# Altium project ROS-Robot-Controller.PrjPcb
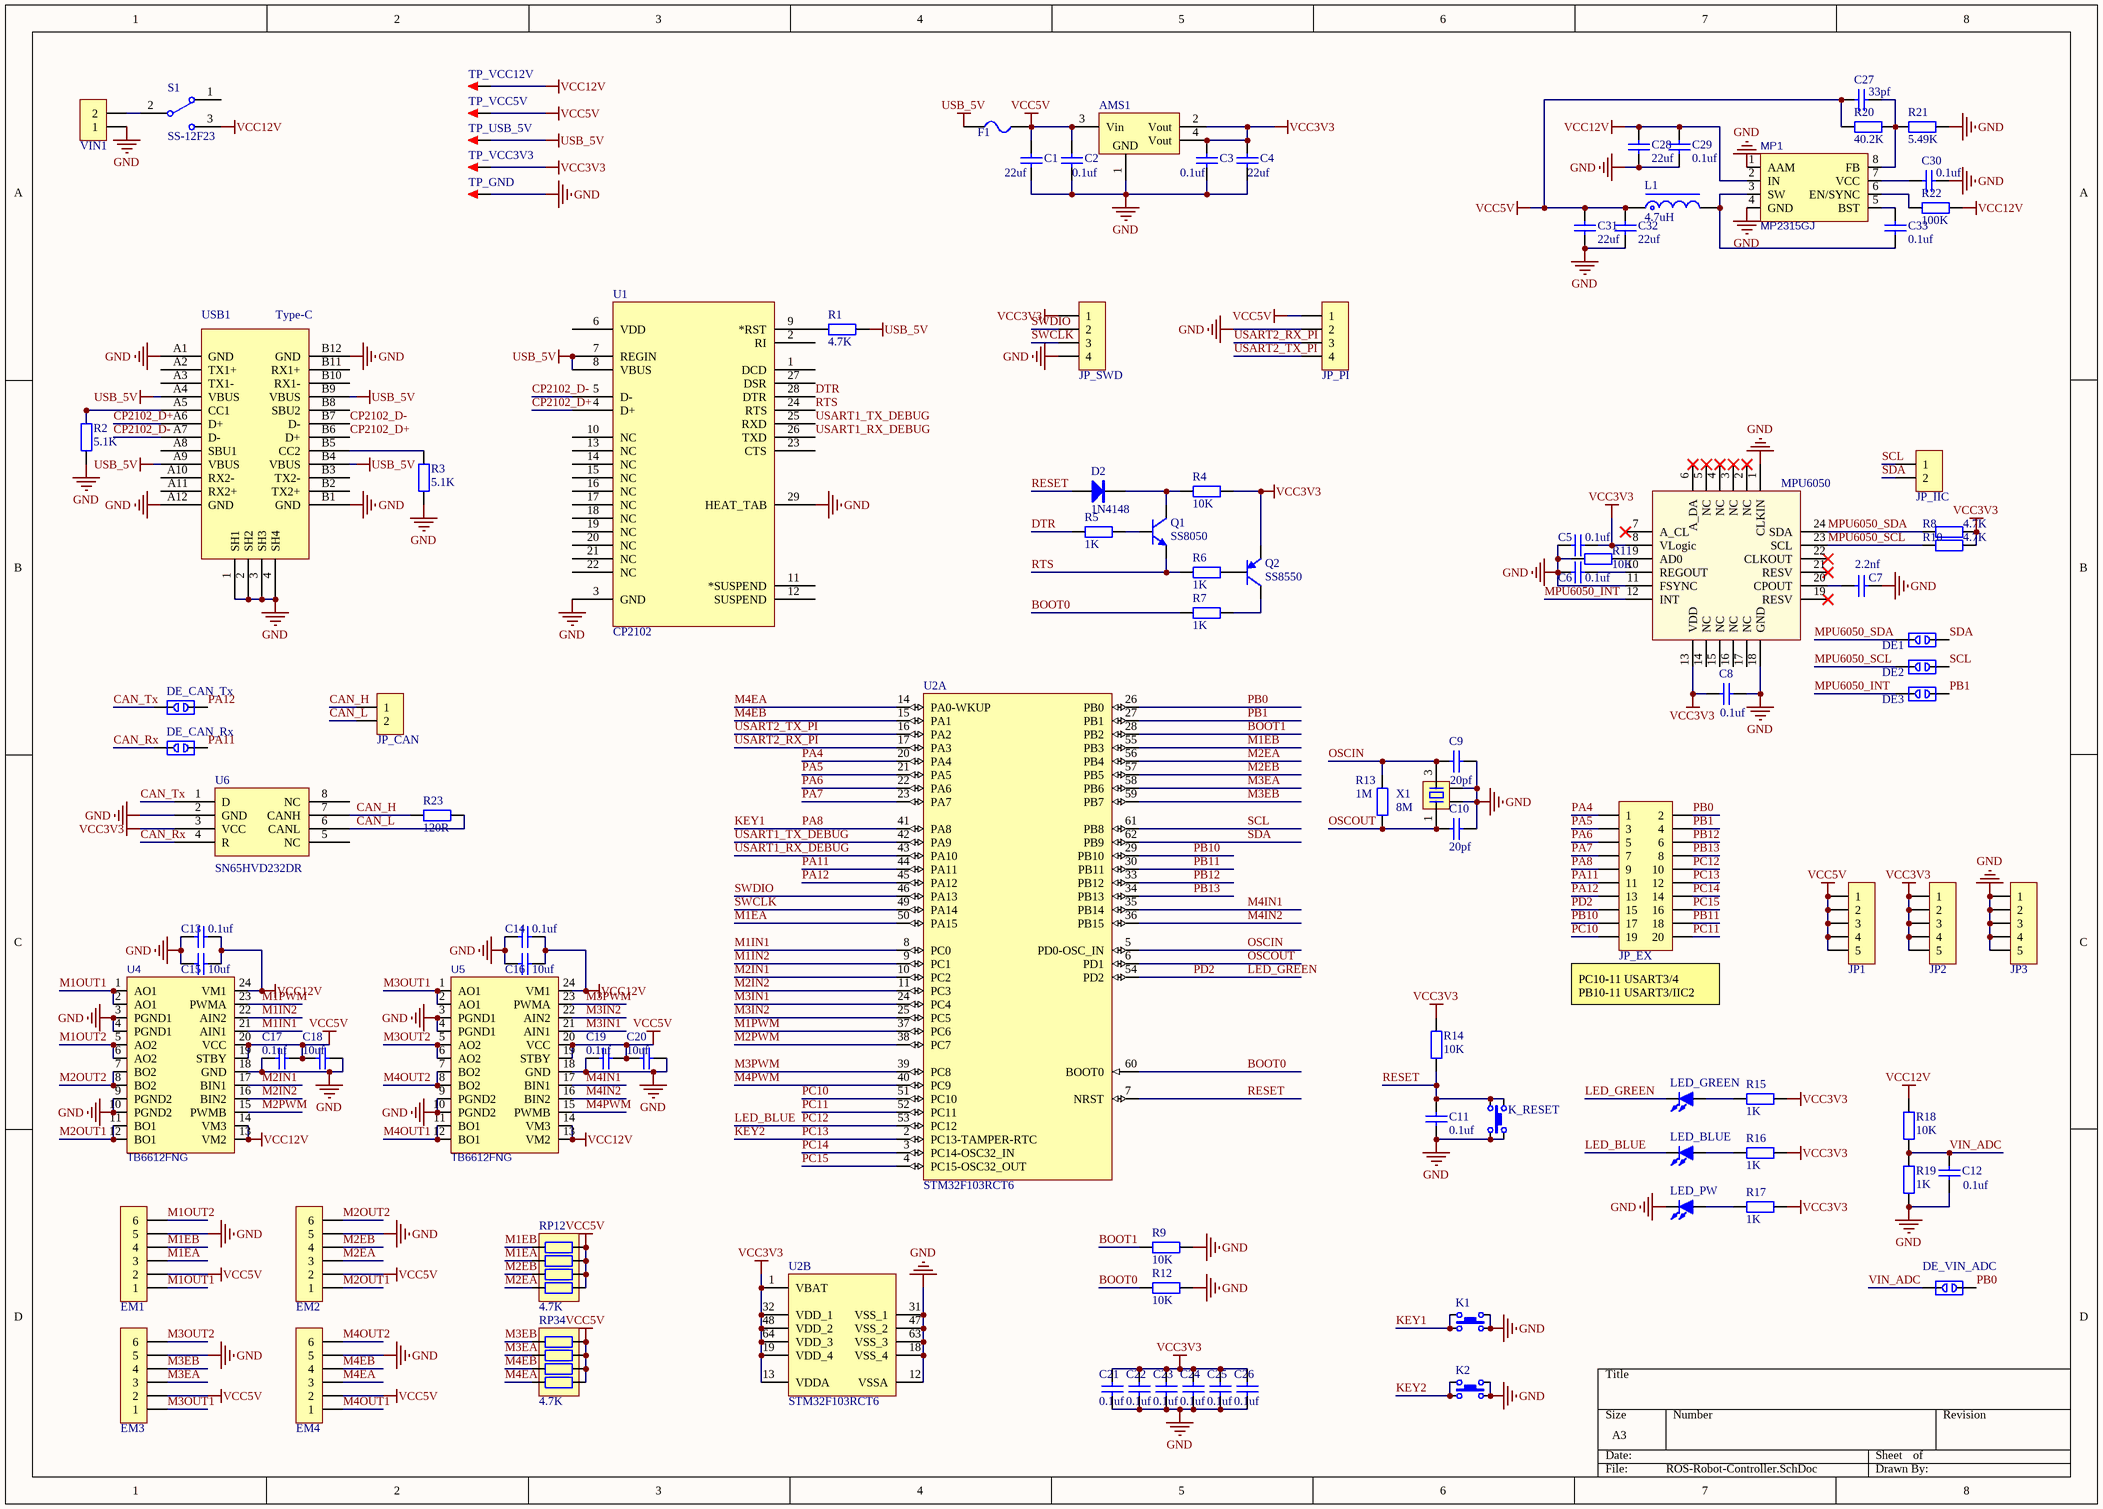
[diagram p0: ROS-Robot-Controller.SchDoc]
1 sheet, 104 parts. Net scope: global (net labels, ports and power ports of the same name join across sheets).
Board file: ROS-Robot-Controller.PcbDoc

## Sheet ROS-Robot-Controller.SchDoc
size A3; SheetNumber: 1; SheetTotal: 1

### Parts
AMS1  AMS1117-3V3  [SOT223_L]  (value not drawn)
C1  22uf  [C0603_L]
C2  0.1uf  [C0603_L]
C3  0.1uf  [C0603_L]
C4  22uf  [C0603_L]
C5  0.1uf  [C0402_L]
C6  0.1uf  [C0402_L]
C7  2.2nf  [C0402_L]
C8  0.1uf  [C0402_L]
C9  20pf  [C0402_L]
C10  20pf  [C0402_L]
C11  0.1uf  [C0402_L]
C12  0.1uf  [C0603_L]
C13  0.1uf  [C0603_L]
C14  0.1uf  [C0603_L]
C15  10uf  [C0603_L]
C16  10uf  [C0603_L]
C17  0.1uf  [C0402_L]
C18  10uf  [C0402_L]
C19  0.1uf  [C0402_L]
C20  10uf  [C0402_L]
C21  0.1uf  [C0402_L]
C22  0.1uf  [C0402_L]
C23  0.1uf  [C0402_L]
C24  0.1uf  [C0402_L]
C25  0.1uf  [C0402_L]
C26  0.1uf  [C0402_L]
C27  33pf  [C0603_L]
C28  22uf  [C0805_L]
C29  0.1uf  [C0805_L]
C30  0.1uf  [C0603_L]
C31  22uf  [C0603_L]
C32  22uf  [C0603_L]
C33  0.1uf  [C0603_L]
D2  1N4148  [SOD-323]
DE1  DEBUG PAD  [DEBUG_B]  (value not drawn)
DE2  DEBUG PAD  [DEBUG_B]  (value not drawn)
DE3  DEBUG PAD  [DEBUG_B]  (value not drawn)
DE_CAN_Rx  DEBUG PAD  [DEBUG_B]  (value not drawn)
DE_CAN_Tx  DEBUG PAD  [DEBUG_B]  (value not drawn)
DE_VIN_ADC  DEBUG PAD  [DEBUG_B]  (value not drawn)
EM1  HDR-1X6  [XH2.54-LI-6P]  (value not drawn)
EM2  HDR-1X6  [XH2.54-LI-6P]  (value not drawn)
EM3  HDR-1X6  [XH2.54-LI-6P]  (value not drawn)
EM4  HDR-1X6  [XH2.54-LI-6P]  (value not drawn)
F1  MSMD200-8V 2A  [FU 0603]  (value not drawn)
JP1  HDR-1X5  [HDR2.54-LI-5P]  (value not drawn)
JP2  HDR-1X5  [HDR2.54-LI-5P]  (value not drawn)
JP3  HDR-1X5  [HDR2.54-LI-5P]  (value not drawn)
JP_CAN  HDR-1X2  [HDR2.54-LI-2P]  (value not drawn)
JP_EX  Header 2X10  [HDR2.54-LI-2x10P]  (value not drawn)
JP_IIC  HDR-1X2  [HDR2.54-LI-2P]  (value not drawn)
JP_PI  HDR-1X4  [HDR2.54-LI-4P]  (value not drawn)
JP_SWD  HDR-1X4  [XH2.54-WI-4P]  (value not drawn)
K1  TACT 4P  [SW-SMD_4P-L4.2-W3.3-P2.15-LS5.1]  (value not drawn)
K2  TACT 4P  [SW-SMD_4P-L4.2-W3.3-P2.15-LS5.1]  (value not drawn)
K_RESET  TACT 4P  [SW-SMD_4P-L4.2-W3.3-P2.15-LS5.1]  (value not drawn)
L1  4.7uH  [L-SMD-0420]
LED_BLUE  红色  [LED_0402_RED]  (value not drawn)
LED_GREEN  红色  [LED_0402_RED]  (value not drawn)
LED_PW  红色  [LED_0402_RED]  (value not drawn)
MP1  MP2315GJ  [SOT23-8N]
Q1  SS8050  [SOT23-3N]
Q2  SS8550  [SOT23-3N]
R1  4.7K  [R0402_L]
R2  5.1K  [R0402_L]
R3  5.1K  [R0402_L]
R4  10K  [R0402_L]
R5  1K  [R0402_L]
R6  1K  [R0402_L]
R7  1K  [R0402_L]
R8  4.7K  [R0402_L]
R9  10K  [R0402_L]
R10  4.7K  [R0402_L]
R11  10K  [R0402_L]
R12  10K  [R0402_L]
R13  1M  [R0402_L]
R14  10K  [R0402_L]
R15  1K  [R0402_L]
R16  1K  [R0402_L]
R17  1K  [R0402_L]
R18  10K  [R0603_L]
R19  1K  [R0603_L]
R20  40.2K  [R0603_L]
R21  5.49K  [R0603_L]
R22  100K  [R0603_L]
R23  120R  [R0402_L]
RP12  4.7K  [RCA-8P4R-0402]
RP34  4.7K  [RCA-8P4R-0402]
S1  SS-12F23  [SS-12D10]
TP_GND  TEST  [TEST 1]  (value not drawn)
TP_USB_5V  TEST  [TEST 1]  (value not drawn)
TP_VCC3V3  TEST  [TEST 1]  (value not drawn)
TP_VCC5V  TEST  [TEST 1]  (value not drawn)
TP_VCC12V  TEST  [TEST 1]  (value not drawn)
U1  CP2102  [QFN-28]
U2  STM32F103RCT6  [LQFP64_N]  (parts A,B of 2)
U3  MPU6050  [QFN-24]
U4  TB6612FNG  [SSOP24_M]
U5  TB6612FNG  [SSOP24_M]
U6  Manufacturer Part Number: SN65HVD232DR  [SO-8]  (hidden comment: SN65HVD232D)
USB1  Type-C  [Type-C-TOP]
VIN1  HDR-1X2  [KF301-5.0-2P]  (value not drawn)
X1  8M  [OSC 3225-4P]

### Nets
GND: AMS1.1(GND) C1.1 C2.1 C3.1 C4.1 C5.1 C6.1 C7.2 C8.2 C9.2 C10.2 C11.1 C12.1 C13.1 C14.1 C15.1 C16.1 C17.2 C18.1 C19.2 C20.1 C21.1 C22.1 C23.1 C24.1 C25.1 C26.1 C28.1 C29.1 C30.1 C31.1 C32.1 EM1.5 EM2.5 EM3.5 EM4.5 JP3.1 JP3.2 JP3.3 JP3.4 JP3.5 JP_PI.2 JP_SWD.4 K1.2 K1.4 K2.2 K2.4 K_RESET.2 K_RESET.4 LED_PW.2(K) MP1.1(AAM) MP1.4(GND) R2.1 R3.1 R9.2 R11.1 R12.2 R19.1 R21.2 TP_GND.1 U1.3(GND) U1.29(HEAT_TAB) U2.12(VSSA) U2.18(VSS_4) U2.31(VSS_1) U2.47(VSS_2) U2.63(VSS_3) U3.1(CLKIN) U3.11(FSYNC) U3.18(GND) U4.3(PGND1) U4.4(PGND1) U4.9(PGND2) U4.10(PGND2) U4.18(GND) U5.3(PGND1) U5.4(PGND1) U5.9(PGND2) U5.10(PGND2) U5.18(GND) U6.2(GND) USB1.1(SH1) USB1.2(SH2) USB1.3(SH3) USB1.4(SH4) USB1.A1(GND) USB1.A12(GND) USB1.B1(GND) USB1.B12(GND) VIN1.1 X1.2 X1.4
USB_5V: F1.1 R1.2 TP_USB_5V.1 U1.7(REGIN) U1.8(VBUS) USB1.A4(VBUS) USB1.A9(VBUS) USB1.B4(VBUS) USB1.B9(VBUS)
VCC3V3: AMS1.2(Vout) AMS1.4(Vout) C3.2 C4.2 C5.2 C8.1 C21.2 C22.2 C23.2 C24.2 C25.2 C26.2 JP2.1 JP2.2 JP2.3 JP2.4 JP2.5 JP_SWD.1 Q2.2(E) R4.1 R8.2 R10.2 R14.2 R15.2 R16.2 R17.2 TP_VCC3V3.1 U2.1(VBAT) U2.13(VDDA) U2.19(VDD_4) U2.32(VDD_1) U2.48(VDD_2) U2.64(VDD_3) U3.8(VLogic) U3.13(VDD) U6.3(VCC)
VCC5V: AMS1.3(Vin) C1.2 C2.2 C17.1 C18.2 C19.1 C20.2 C27.2 C31.2 C32.2 EM1.2 EM2.2 EM3.2 EM4.2 F1.2 JP1.1 JP1.2 JP1.3 JP1.4 JP1.5 JP_PI.1 L1.1 R20.1 RP12.5 RP12.6 RP12.7 RP12.8 RP34.5 RP34.6 RP34.7 RP34.8 TP_VCC5V.1 U4.19(STBY) U4.20(VCC) U5.19(STBY) U5.20(VCC)
VCC12V: C13.2 C14.2 C15.2 C16.2 C28.2 C29.2 MP1.2(IN) R18.2 R22.2 S1.3 TP_VCC12V.1 U4.13(VM2) U4.14(VM3) U4.24(VM1) U5.13(VM2) U5.14(VM3) U5.24(VM1)
BOOT0: R7.2 R12.1 U2.60(BOOT0)
BOOT1: R9.1 U2.28(PB2)
CAN_H: JP_CAN.1 R23.1 U6.7(CANH)
CAN_L: JP_CAN.2 R23.2 U6.6(CANL)
CAN_Rx: DE_CAN_Rx.1 U6.4(R)
CAN_Tx: DE_CAN_Tx.1 U6.1(D)
CP2102_D+: U1.4(D+) USB1.A6(D+) USB1.B6(D+)
CP2102_D-: U1.5(D-) USB1.A7(D-) USB1.B7(D-)
DTR: R5.1 U1.28(DTR)
KEY1: JP_EX.9 K1.1 K1.3 U2.41(PA8)  [also labelled PA8]
KEY2: JP_EX.12 K2.1 K2.3 U2.2(PC13-TAMPER-RTC)  [also labelled PC13]
LED_BLUE: JP_EX.10 LED_BLUE.2(K) U2.53(PC12)  [also labelled PC12]
LED_GREEN: JP_EX.15 LED_GREEN.2(K) U2.54(PD2)  [also labelled PD2]
M1EA: EM1.3 RP12.2 U2.50(PA15)
M1EB: EM1.4 RP12.1 U2.55(PB3)
M1IN1: U2.8(PC0) U4.21(AIN1)
M1IN2: U2.9(PC1) U4.22(AIN2)
M1OUT1: EM1.1 U4.1(AO1) U4.2(AO1)
M1OUT2: EM1.6 U4.5(AO2) U4.6(AO2)
M1PWM: U2.37(PC6) U4.23(PWMA)
M2EA: EM2.3 RP12.4 U2.56(PB4)
M2EB: EM2.4 RP12.3 U2.57(PB5)
M2IN1: U2.10(PC2) U4.17(BIN1)
M2IN2: U2.11(PC3) U4.16(BIN2)
M2OUT1: EM2.1 U4.11(BO1) U4.12(BO1)
M2OUT2: EM2.6 U4.7(BO2) U4.8(BO2)
M2PWM: U2.38(PC7) U4.15(PWMB)
M3EA: EM3.3 RP34.2 U2.58(PB6)
M3EB: EM3.4 RP34.1 U2.59(PB7)
M3IN1: U2.24(PC4) U5.21(AIN1)
M3IN2: U2.25(PC5) U5.22(AIN2)
M3OUT1: EM3.1 U5.1(AO1) U5.2(AO1)
M3OUT2: EM3.6 U5.5(AO2) U5.6(AO2)
M3PWM: U2.39(PC8) U5.23(PWMA)
M4EA: EM4.3 RP34.4 U2.14(PA0-WKUP)
M4EB: EM4.4 RP34.3 U2.15(PA1)
M4IN1: U2.35(PB14) U5.17(BIN1)
M4IN2: U2.36(PB15) U5.16(BIN2)
M4OUT1: EM4.1 U5.11(BO1) U5.12(BO1)
M4OUT2: EM4.6 U5.7(BO2) U5.8(BO2)
M4PWM: U2.40(PC9) U5.15(PWMB)
MPU6050_INT: DE3.1 U3.12(INT)
MPU6050_SCL: DE2.1 R10.1 U3.23(SCL)
MPU6050_SDA: DE1.1 R8.1 U3.24(SDA)
OSCIN: C9.1 R13.2 U2.5(PD0-OSC_IN) X1.3
OSCOUT: C10.1 R13.1 U2.6(PD1) X1.1
PA4: JP_EX.1 U2.20(PA4)
PA5: JP_EX.3 U2.21(PA5)
PA6: JP_EX.5 U2.22(PA6)
PA7: JP_EX.7 U2.23(PA7)
PA11: DE_CAN_Rx.2 JP_EX.11 U2.44(PA11)
PA12: DE_CAN_Tx.2 JP_EX.13 U2.45(PA12)
PB0: DE_VIN_ADC.2 JP_EX.2 U2.26(PB0)
PB1: DE3.2 JP_EX.4 U2.27(PB1)
PB10: JP_EX.17 U2.29(PB10)
PB11: JP_EX.18 U2.30(PB11)
PB12: JP_EX.6 U2.33(PB12)
PB13: JP_EX.8 U2.34(PB13)
PC10: JP_EX.19 U2.51(PC10)
PC11: JP_EX.20 U2.52(PC11)
PC14: JP_EX.14 U2.3(PC14-OSC32_IN)
PC15: JP_EX.16 U2.4(PC15-OSC32_OUT)
RESET: C11.2 D2.1(A) K_RESET.1 K_RESET.3 R14.1 U2.7(NRST)
RTS: Q1.2(E) R6.1 U1.24(RTS)
SCL: DE2.2 JP_IIC.1 U2.61(PB8)
SDA: DE1.2 JP_IIC.2 U2.62(PB9)
SWCLK: JP_SWD.3 U2.49(PA14)
SWDIO: JP_SWD.2 U2.46(PA13)
USART1_RX_DEBUG: U1.26(TXD) U2.43(PA10)
USART1_TX_DEBUG: U1.25(RXD) U2.42(PA9)
USART2_RX_PI: JP_PI.3 U2.17(PA3)
USART2_TX_PI: JP_PI.4 U2.16(PA2)
VIN_ADC: C12.2 DE_VIN_ADC.1 R18.1 R19.2
NetC6_2: C6.2 U3.10(REGOUT)
NetC7_1: C7.1 U3.20(CPOUT)
NetC27_1: C27.1 MP1.8(FB) R20.2 R21.1
NetC30_2: C30.2 MP1.7(VCC)
NetC33_1: C33.1 L1.2 MP1.3(SW)
NetC33_2: C33.2 MP1.5(BST)
NetD2_2: D2.2(K) Q1.3(C) R4.2
NetLED_BLUE_1: LED_BLUE.1(A) R16.1
NetLED_GREEN_1: LED_GREEN.1(A) R15.1
NetLED_PW_1: LED_PW.1(A) R17.1
NetMP1_6: MP1.6(EN/SYNC) R22.1
NetQ1_1: Q1.1(B) R5.2
NetQ2_1: Q2.1(B) R6.2
NetQ2_3: Q2.3(C) R7.1
NetR1_1: R1.1 U1.9(*RST)
NetR2_2: R2.2 USB1.A5(CC1)
NetR3_2: R3.2 USB1.B5(CC2)
NetR11_2: R11.2 U3.9(AD0)
NetS1_2: S1.2 VIN1.2

Not connected (* = marked no-connect by the designer): S1 1; U1 1(DCD) 2(RI) 6(VDD) 10(NC) 11(*SUSPEND) 12(SUSPEND) 13(NC) 14(NC) 15(NC) 16(NC) 17(NC) 18(NC) 19(NC) 20(NC) 21(NC) 22(NC) 23(CTS) 27(DSR); U3 2(NC)* 3(NC)* 4(NC)* 5(NC)* 6(A_DA)* 7(A_CL)* 14(NC) 15(NC) 16(NC) 17(NC) 19(RESV)* 21(RESV)* 22(CLKOUT)*; U6 5(NC) 8(NC); USB1 A2(TX1+) A3(TX1-) A8(SBU1) A10(RX2-) A11(RX2+) B2(TX2+) B3(TX2-) B8(SBU2) B10(RX1-) B11(RX1+)

### Notes on the sheet
- (near JP_EX) PC10-11 USART3/4
  PB10-11 USART3/IIC2

### Library data of the parts
AMS1 = AMS1117: 三端稳压芯片; BOM名称: 稳压芯片; 封装库来自淘宝卖家 ID：黄晶宝石: 其他店铺购入均为盗版，请立即申请退款，本店现金奖励5~20元; 联系卖家 免费查找封装: 唯一出售店铺网址https://shop463601444.taobao.com
C1-C33 = C: 贴片电容; BOM名称: 无极性贴片电容; 联系卖家，免费查找封装: 唯一出售店铺网址https://shop463601444.taobao.com; 封装库来自淘宝卖家ID：黄晶宝石: 其他店铺购入均为盗版假冒封装库，请立即申请退款
D2 = 1N4148: 开关二极管; BOM名称: 高速开关二极管; 联系卖家，免费查找封装: 唯一出售店铺网址https://shop463601444.taobao.com
DE1-DE3 DE_CAN_Rx DE_CAN_Tx DE_VIN_ADC = DEBUG: 调试断点焊盘; 联系卖家，免费查找封装: 唯一出售店铺网址https://shop463601444.taobao.com; BOM名称: 调试断点焊盘
EM1-EM4 = Header 6: 6P接插件; 封装库来自淘宝卖家 ID：黄晶宝石: 其他店铺购入均为盗版假冒封装库; 联系卖家，免费查找封装: 唯一出售店铺网址https://shop463601444.taobao.com; BOM名称: 6P接插件
F1 = FU: 贴片保险丝; 联系卖家，免费查找封装: 唯一出售店铺网址https://shop463601444.taobao.com; BOM名称: 贴片保险丝
JP1-JP3 = Header 5: 5P接插件; 封装库来自淘宝卖家 ID：黄晶宝石: 其他店铺购入均为盗版假冒封装库; 联系卖家，免费查找封装: 唯一出售店铺网址https://shop463601444.taobao.com; BOM名称: 5P接插件
JP_CAN JP_IIC = Header 2: 2P接插件; 封装库来自淘宝卖家 ID：黄晶宝石: 其他店铺购入均为盗版假冒封装库; 联系卖家，免费查找封装: 唯一出售店铺网址https://shop463601444.taobao.com; BOM名称: 2P接插件
JP_EX = Header 10X2: 10*2P接插件; 封装库来自淘宝卖家 ID：黄晶宝石: 其他店铺购入均为盗版假冒封装库; 联系卖家，免费查找封装: 唯一出售店铺网址https://shop463601444.taobao.com; BOM名称: 10*2P接插件
JP_PI JP_SWD = Header 4: 4P接插件; 封装库来自淘宝卖家 ID：黄晶宝石: 其他店铺购入均为盗版假冒封装库; 联系卖家，免费查找封装: 唯一出售店铺网址https://shop463601444.taobao.com; BOM名称: 4P接插件
K1 K2 K_RESET = ButtonTACT: Button; pin to pad: 2>3 3>2; value: 3.4x3.5; type: TACT 4P
L1 = L-Molding Choke: 一体成型电感; 联系卖家，免费查找封装: 唯一出售店铺网址https://shop463601444.taobao.com; 封装库来自淘宝卖家ID：黄晶宝石: 其他店铺购入均为盗版假冒封装库，请立即申请退款; BOM名称: 一体成型电感
LED_BLUE LED_GREEN LED_PW = LED-SMD: 贴片LED; 封装库来自淘宝卖家 ID：黄晶宝石: 其他店铺购入均为假冒，请立即申请退款，本店奖励现金5~20元; BOM名称: 贴片LED
MP1 = MP2315: 3A/24V DC-DC降压芯片; 封装库来自淘宝卖家 ID：黄晶宝石: 其他店铺购入均为盗版，请立即申请退款，本店现金奖励5~20元; 联系卖家 免费查找封装: 唯一出售店铺网址https://shop463601444.taobao.com
Q1 = 8050-SMD: 高频放大-NPN型; 联系卖家，免费查找封装: 唯一出售店铺网址https://shop463601444.taobao.com; 封装库来自淘宝卖家 ID：黄晶宝石: 其他店铺购入均为盗版，不享受售后技术支持服务，请立即申请退款; 参数: 40V 1.5A 1W 100MHZ; BOM名称: 高频放大-NPN型
Q2 = 8550-SMD: 高频放大-PNP型; 联系卖家，免费查找封装: 唯一出售店铺网址https://shop463601444.taobao.com; 封装库来自淘宝卖家 ID：黄晶宝石: 其他店铺购入均为盗版，不享受售后技术支持服务，请立即申请退款; 参数: 40V 1.5A 1W 100MHZ; BOM名称: 高频放大-PNP型
R1-R23 = R: 贴片电阻; 联系卖家，免费查找封装: 唯一出售店铺网址https://shop463601444.taobao.com; 封装库来自淘宝卖家ID：黄晶宝石: 其他店铺购入均为盗版假冒封装库，请立即申请退款; BOM名称: 贴片电阻
RP12 RP34 = R-8P4R: 贴片4P排阻; BOM名称: 贴片网络排阻; 联系卖家，免费查找封装: 唯一出售店铺网址https://shop463601444.taobao.com; 封装库来自淘宝卖家ID：黄晶宝石: 其他店铺购入均为盗版假冒封装库，请立即申请退款
S1 = SSW-1P: 1路波动开关; BOM名称: 波动开关; 联系卖家，免费查找封装: 唯一出售店铺网址https://shop463601444.taobao.com
TP_GND TP_USB_5V TP_VCC3V3 TP_VCC5V TP_VCC12V = TEST: 测试点; 联系卖家，免费查找封装: 唯一出售店铺网址https://shop463601444.taobao.com; BOM名称: 测试点
U1 = CP2102: USB转TTL; PART DESC: SINGLE-CHIP USB TO UART BRIDGE, QFN28, RoHS.; MFG #1: SILICON LABS; PART NUMBER: CP2102; Value: Value; RefDes: RefDes; Type: DEV
U2 = STM32F103RCT6: STM32 ARM-based 32-bit MCU Performance Line with 256 kB Flash, 48 kB Internal RAM, -40 to +85癈 Temperature, 64-Pin LQFP, Tray; 联系卖家，免费查找封装: 唯一出售店铺网址https://shop463601444.taobao.com; DatasheetVersion: rev8.0, Apr-2011; PackageVersion: rev13, Apr-2011; PackageReference: LQFP64; PackageDescription: 64-Pin Low-Profile Quad Flat Pack, 10 x 10 mm Body, 0.5 mm Pitch (LQFP64); ComponentLink1Description: Manufacturer URL; ComponentLink1URL: http://www.st.com/; ComponentLink2Description: STM32F103 Datasheet; ComponentLink2URL: http://www.st.com/internet/com/TECHNICAL_RESOURCES/TECHNICAL_LITERATURE/DATASHEET/CD00191185.pdf; ComponentLink3Description: STM32 Family Web Page; ComponentLink3URL: www.st.com/stm32
U3 = MPU6050: 六轴传感器
U4 U5 = TB6612FNG: 电机驱动; 联系卖家，免费查找封装: 唯一出售店铺网址https://shop463601444.taobao.com; BOM名称: TB6612FNG
U6 = SN65HVD232D: Manufacturer: Texas Instruments; Protocol: CAN; Number of Drivers/Receivers: 1/1; Duplex: Half; Data Rate: 1Mbps; Voltage - Supply: 3 V ~ 3.6 V; Supplier 1: Digi-Key; Supplier Part Number 1: 296-26344-2-ND; RoHS: RoHS Compliant; Category: Integrated Circuits (ICs); Stock: 5000; Pricing 1: 2500=0.84375 (USD); Packaging: Tape & Reel (TR); Part Status: Active; Type: Transceiver; Operating Temperature: -40°C ~ 85°C; Mounting Type: Surface Mount; Package / Case: 8-SOIC (0.154", 3.90mm Width); Supplier Device Package: 8-SOIC; ComponentLink1URL: http://www.ti.com/lit/ds/symlink/sn65hvd230.pdf; ComponentLink1Description: http://www.ti.com/lit/ds/symlink/sn65hvd230.pdf; Supplier 2: Digi-Key; Supplier Part Number 2: 296-26344-1-ND; Pricing 2: 1=2.05, 10=1.842, 100=1.4809, 500=1.21668, 1000=1.00811 (USD)
USB1 = USB-Type-C-TOP
VIN1 = Header 2: 2P接插件; 联系卖家，免费技术支持: 唯一出售店铺网址https://shop463601444.taobao.com; 封装库来自淘宝卖家 ID：黄晶宝石: 其他店铺购入均为盗版假冒封装库; BOM名称: 2P接插件
X1 = XTAL-4P: 4脚无源晶振; 联系卖家，免费查找封装: 唯一出售店铺网址https://shop463601444.taobao.com; BOM名称: 4脚无源晶振